# EAGLE schematic list (EAGLE 7.5.0)
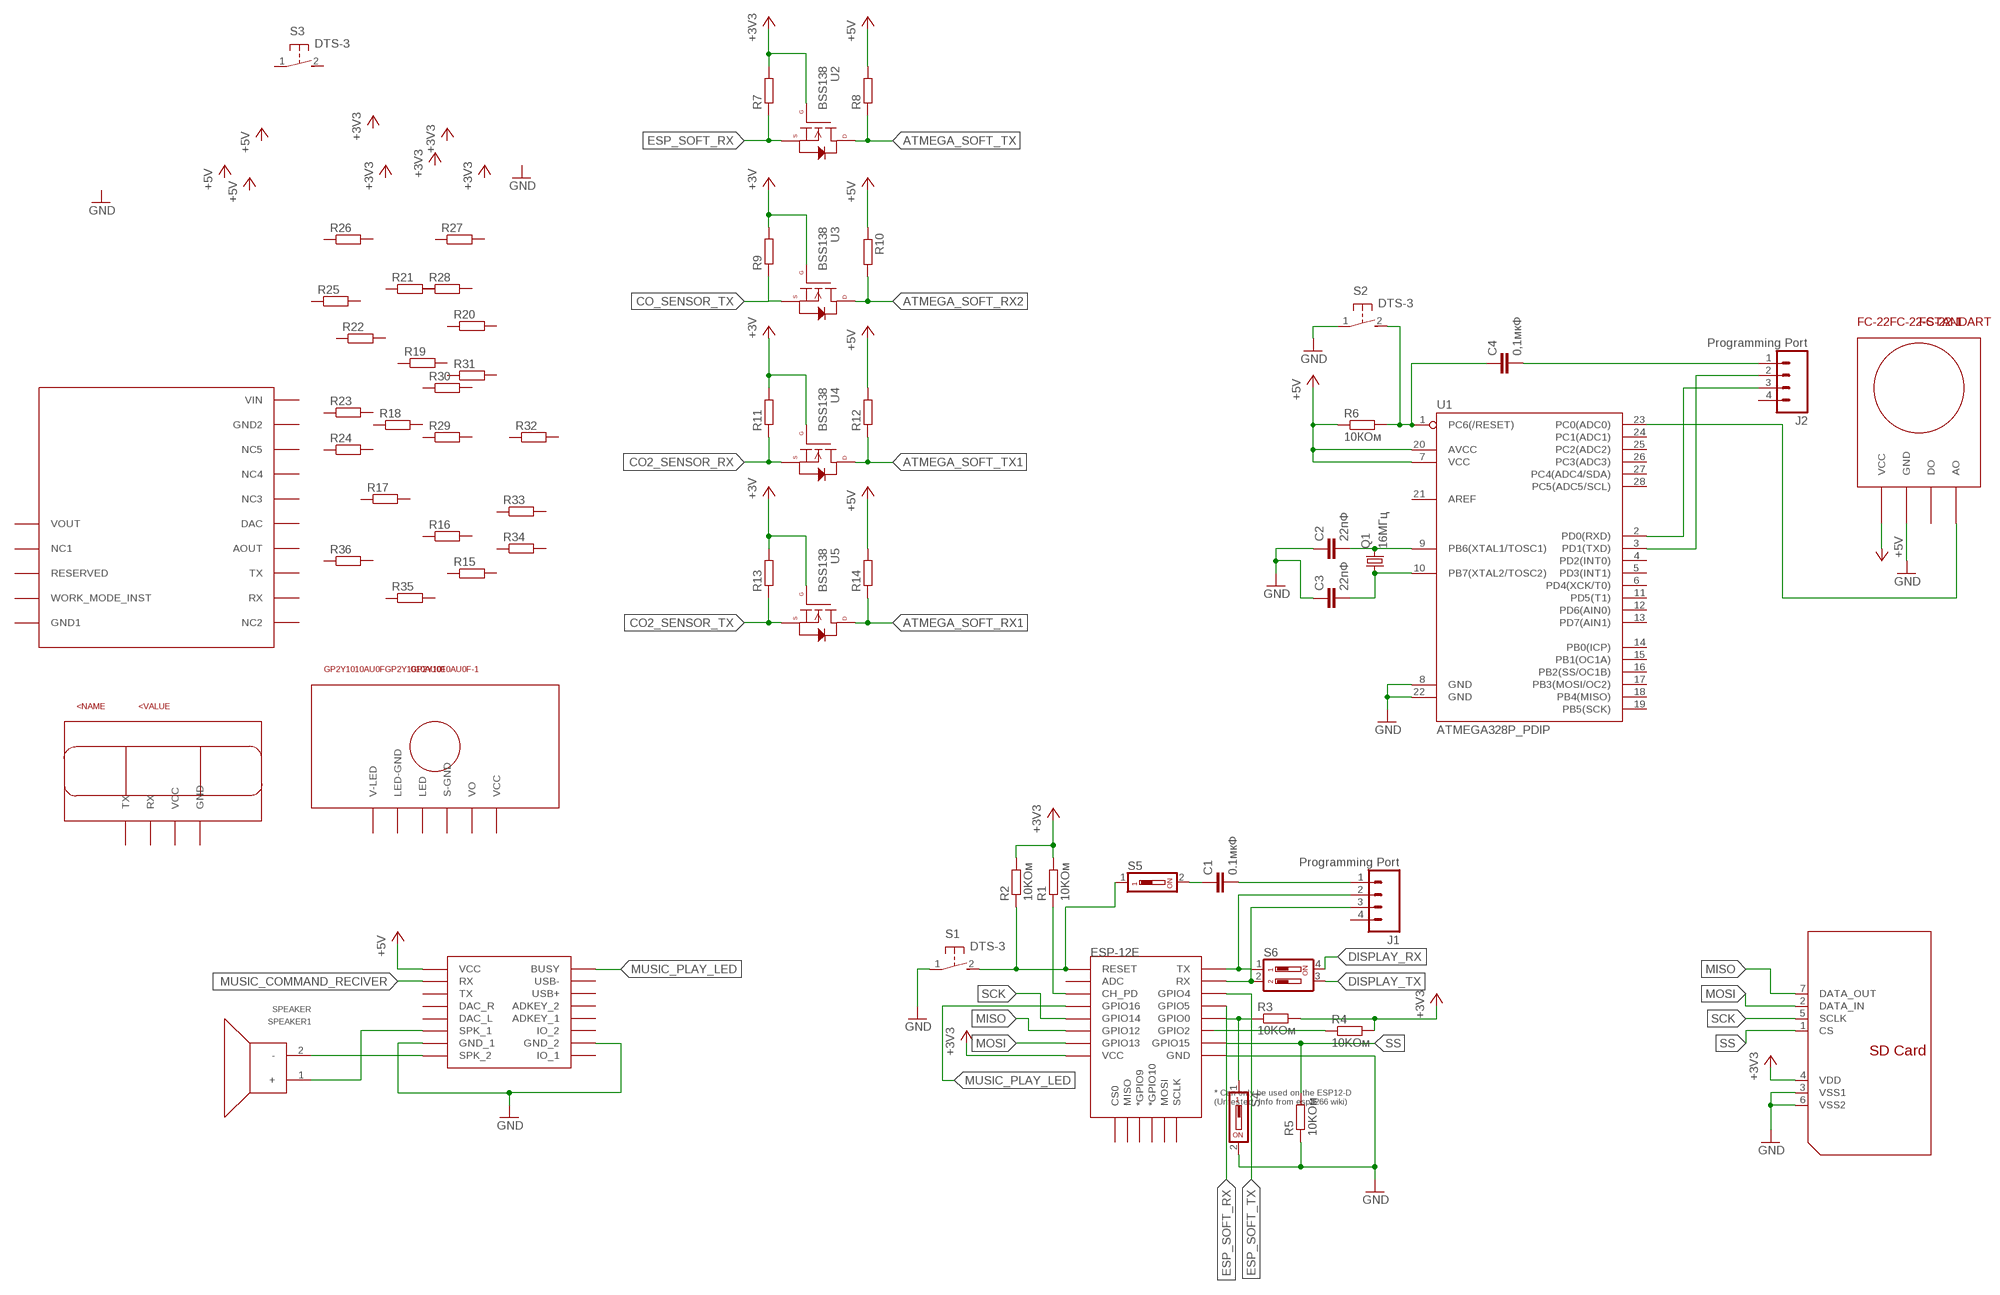
[diagram p0: schematic, sheet 1]

## Parts
C1  0.1мкФ  0.1UF-50V-20%(PTH)KIT-EZ  [CAP-PTH-SMALL-KIT]
C2  22пФ  0.1UF-50V-20%(PTH)KIT-EZ  [CAP-PTH-SMALL-KIT]
C3  22пФ  0.1UF-50V-20%(PTH)KIT-EZ  [CAP-PTH-SMALL-KIT]
C4  0,1мкФ  0.1UF-50V-20%(PTH)KIT-EZ  [CAP-PTH-SMALL-KIT]
ESP-12E  ESP12ESMD  [ESP12E-SMD]
FC-22-1  FC-22FC-22-STANDART  [FC-22]
GP2Y1010AU0F-1  GP2Y1010AU0FGP2Y1010AU0F  [1X06]
J1  Programming Port  M04PTH  [1X04]
J2  Programming Port  M04PTH  [1X04]
MH-Z14-1  MH-Z14  [1X04]
Q1  16МГц  CRYSTALHC33U-V  [HC33U-V]
R1  10KОм  R-EU_0207/10  [0207/10]
R2  10KОм  R-EU_0207/10  [0207/10]
R3  10KОм  R-EU_0207/10  [0207/10]
R4  10KОм  R-EU_0207/10  [0207/10]
R5  10KОм  R-EU_0207/10  [0207/10]
R6  10КОм  R-EU_0207/10  [0207/10]
R7  R-EU_0207/10  [0207/10]
R8  R-EU_0207/10  [0207/10]
R9  R-EU_0207/10  [0207/10]
R10  R-EU_0207/10  [0207/10]
R11  R-EU_0207/10  [0207/10]
R12  R-EU_0207/10  [0207/10]
R13  R-EU_0207/10  [0207/10]
R14  R-EU_0207/10  [0207/10]
R15  R-EU_0207/10  [0207/10]
R16  R-EU_0207/10  [0207/10]
R17  R-EU_0207/10  [0207/10]
R18  R-EU_0207/10  [0207/10]
R19  R-EU_0207/10  [0207/10]
R20  R-EU_0207/10  [0207/10]
R21  R-EU_0207/10  [0207/10]
R22  R-EU_0207/10  [0207/10]
R23  R-EU_0207/10  [0207/10]
R24  R-EU_0207/10  [0207/10]
R25  R-EU_0207/10  [0207/10]
R26  R-EU_0207/10  [0207/10]
R27  R-EU_0207/10  [0207/10]
R28  R-EU_0207/10  [0207/10]
R29  R-EU_0207/10  [0207/10]
R30  R-EU_0207/10  [0207/10]
R31  R-EU_0207/10  [0207/10]
R32  R-EU_0207/10  [0207/10]
R33  R-EU_0207/10  [0207/10]
R34  R-EU_0207/10  [0207/10]
R35  R-EU_0207/10  [0207/10]
R36  R-EU_0207/10  [0207/10]
S1  DTS-3  [DTS-3]
S2  DTS-3  [DTS-3]
S3  DTS-3  [DTS-3]
S4  DS01  [DS-01]
S5  DS01  [DS-01]
S6  DS02  [DS-02]
SDCARD-1  SDCARDSDSTAY  [SD]
SPEAKER1  SPEAKER  [1X02]
U1  ATMEGA328P_PDIP  [DIL28-3]
U2  BSS138  N-CHANNEL-MOSFET-BSS138  [SOT23-3]
U3  BSS138  N-CHANNEL-MOSFET-BSS138  [SOT23-3]
U4  BSS138  N-CHANNEL-MOSFET-BSS138  [SOT23-3]
U5  BSS138  N-CHANNEL-MOSFET-BSS138  [SOT23-3]
U$1  DFPLAYER  [DFPLAYER]
Z07-CO-1  ZE07-CO  [Z07-CO]

## Nets
+3V3: ESP-12E.VCC R1.2 R2.2 R3.2 R4.2 R7.2 U2.1(G)
+5V: FC-22-1.1(VCC) R6.1 R10.1 R12.2 R14.2 U1.7(VCC) U1.20(AVCC) U$1.VCC
ATMEGA_SOFT_RX1: R14.1 U5.3(D)
ATMEGA_SOFT_RX2: R10.2 U3.3(D)
ATMEGA_SOFT_TX: R8.1 U2.3(D)
ATMEGA_SOFT_TX1: R12.1 U4.3(D)
CO2_SENSOR_RX: R11.1 U4.2(S)
CO2_SENSOR_TX: R13.1 U5.2(S)
CO_SENSOR_TX: R9.1 U3.2(S)
DISPLAY_RX: S6.4
DISPLAY_TX: S6.3
ESP_SOFT_RX: ESP-12E.GPIO5 R7.1 U2.2(S)
ESP_SOFT_TX: ESP-12E.GPIO4
GND: C2.1 C3.1 ESP-12E.GND FC-22-1.2(GND) R5.1 S1.1 S2.1 S4.2 U1.8(GND) U1.22(GND) U$1.GND_1 U$1.GND_2
MISO: ESP-12E.GPIO12 SDCARD-1.7(DATA_OUT)
MOSI: ESP-12E.GPIO13 SDCARD-1.2(DATA_IN)
MUSIC_COMMAND_RECIVER: U$1.RX
MUSIC_PLAY_LED: ESP-12E.GPIO16 U$1.BUSY
N$2: ESP-12E.RESET R2.1 S1.2 S5.1
N$3: ESP-12E.CH_PD R1.1
N$4: ESP-12E.GPIO0 R3.1 S4.1
N$5: R4.1
N$6: ESP-12E.RXD0(RX) J1.3 S6.2
N$7: C1.1 S5.2
N$8: C1.2 J1.1
N$9: ESP-12E.TXD0(TX) J1.2 S6.1
N$10: C3.2 Q1.1 U1.10(PB7(XTAL2/TOSC2))
N$11: SPEAKER1.1(+) U$1.SPK1(SPK_1)
N$12: SPEAKER1.2(-) U$1.SPK2(SPK_2)
N$13: C2.2 Q1.2 U1.9(PB6(XTAL1/TOSC1))
N$14: C4.2 J2.1
N$15: J2.2 U1.3(PD1(TXD))
N$16: C4.1 R6.2 S2.2 U1.1(PC6(/RESET))
N$17: J2.3 U1.2(PD0(RXD))
N$18: FC-22-1.4(AO) U1.23(PC0(ADC0))
N$22: R8.2 ; supply symbol labelled +5V
SCK: ESP-12E.GPIO14 SDCARD-1.5(SCLK)
SS: ESP-12E.GPIO15 R5.2 SDCARD-1.1(CS)
VCC: R9.2 R11.2 R13.2 U3.1(G) U4.1(G) U5.1(G) ; supply symbol labelled +3V
VDD: SDCARD-1.4(VDD) ; supply symbol labelled +3V3
VSS2: SDCARD-1.3(VSS1) SDCARD-1.6(VSS2) ; supply symbol labelled GND
Unconnected: ESP-12E.ADC ESP-12E.CS0 ESP-12E.GPIO2 ESP-12E.GPIO9(*GPIO9) ESP-12E.GPIO10(*GPIO10) ESP-12E.MISO ESP-12E.MOSI ESP-12E.SCLK FC-22-1.3(DO) GP2Y1010AU0F-1.3(LED) GP2Y1010AU0F-1.5(VO) J1.4 J2.4 MH-Z14-1.1(TX) MH-Z14-1.2(RX) R15.1 R15.2 R16.1 R16.2 R17.1 R17.2 R18.1 R18.2 R19.1 R19.2 R20.1 R20.2 R21.1 R21.2 R22.1 R22.2 R23.1 R23.2 R24.1 R24.2 R25.1 R25.2 R26.1 R26.2 R27.1 R27.2 R28.1 R28.2 R29.1 R29.2 R30.1 R30.2 R31.1 R31.2 R32.1 R32.2 R33.1 R33.2 R34.1 R34.2 R35.1 R35.2 R36.1 R36.2 S3.1 S3.2 U1.4(PD2(INT0)) U1.5(PD3(INT1)) U1.6(PD4(XCK/T0)) U1.11(PD5(T1)) U1.12(PD6(AIN0)) U1.13(PD7(AIN1)) U1.14(PB0(ICP)) U1.15(PB1(OC1A)) U1.16(PB2(SS/OC1B)) U1.17(PB3(MOSI/OC2)) U1.18(PB4(MISO)) U1.19(PB5(SCK)) U1.21(AREF) U1.24(PC1(ADC1)) U1.25(PC2(ADC2)) U1.26(PC3(ADC3)) U1.27(PC4(ADC4/SDA)) U1.28(PC5(ADC5/SCL)) U$1.ADKEY1(ADKEY_1) U$1.ADKEY2(ADKEY_2) U$1.DAC_L U$1.DAC_R U$1.IO1(IO_1) U$1.IO2(IO_2) U$1.TX U$1.USB+ U$1.USB- Z07-CO-1.2(NC1) Z07-CO-1.3(RESERVED) Z07-CO-1.4(WORK_MODE_INST) Z07-CO-1.6(NC2) Z07-CO-1.7(RX) Z07-CO-1.8(TX) Z07-CO-1.9(AOUT) Z07-CO-1.10(DAC) Z07-CO-1.11(NC3) Z07-CO-1.12(NC4) Z07-CO-1.13(NC5)

## Power pins joined to a net without a drawn wire
GND: MH-Z14-1.4(GND)
GND1: Z07-CO-1.5(GND1)
GND2: Z07-CO-1.14(GND2)
LED-GND: GP2Y1010AU0F-1.2(LED-GND)
S-GND: GP2Y1010AU0F-1.4(S-GND)
V-LED: GP2Y1010AU0F-1.1(V-LED)
VCC: GP2Y1010AU0F-1.6(VCC) MH-Z14-1.3(VCC)
VIN: Z07-CO-1.15(VIN)
VOUT: Z07-CO-1.1(VOUT)

## Library data of the parts
C1-C4 = SparkFun-Capacitors:0.1UF-50V-20%(PTH): CAP-08370; PROD_ID: CAP-08370
ESP-12E = esp8266modules:ESP12E: ESP12E Module
FC-22-1 = diplom:FC-22
GP2Y1010AU0F-1 = diplom:GP2Y1010AU0F
J1 J2 = SparkFun-Connectors:M04: Header 4 Standard 4-pin 0.1" header. Use with straight break away headers (SKU : PRT-00116), right angle break away headers (PRT-00553), swiss pins (PRT-00743), machine pins (PRT-00117), and female headers (PRT-00115). Molex polarized connector foot print use with SKU : PRT-08231 with associated crimp pins and housings. 1MM SMD Version SKU: PRT-10208; PROD_ID: CONN-09696
MH-Z14-1 = diplom:MH-Z14
Q1 = crystal:CRYSTAL: CRYSTAL; OC_FARNELL: unknown; OC_NEWARK: unknown
R1-R36 = rcl:R-EU_: RESISTOR, European symbol
S1-S3 = switch-tact:DTS-3
S4 S5 = switch-dil:DS01: DIL/CODE SWITCH; OC_FARNELL: unknown; OC_NEWARK: unknown
S6 = switch-dil:DS02: DIL/CODE SWITCH; OC_FARNELL: 9472126; OC_NEWARK: unknown
SDCARD-1 = diplom:SDCARD
SPEAKER1 = diplom:SPEAKER
U1 = SparkFun-DigitalIC:ATMEGA328P_PDIP: uC used in the Arduino 32kb flash, 1k EEPROM, 2k SRAM This is the through-hole version of this chip.
U2-U5 = GeekAmmo:N-CHANNEL-MOSFET: N-Channel MOSFET Mode Field Effect Transistor; DATASHEET: http://www.fairchildsemi.com/ds/BS/BSS138.pdf; DIGIKEY: BSS138TR-ND; ELEMENT14: 2323154; URL: http://au.element14.com/fairchild-semiconductor/bss138/mosfet-n-ch-50v-220ma-sot-23/dp/2323154
U$1 = DFPlayer_v1:DFPLAYER
Z07-CO-1 = diplom:ZE07-CO